# EAGLE design atmega328_dip_board (EAGLE 9.6.2)
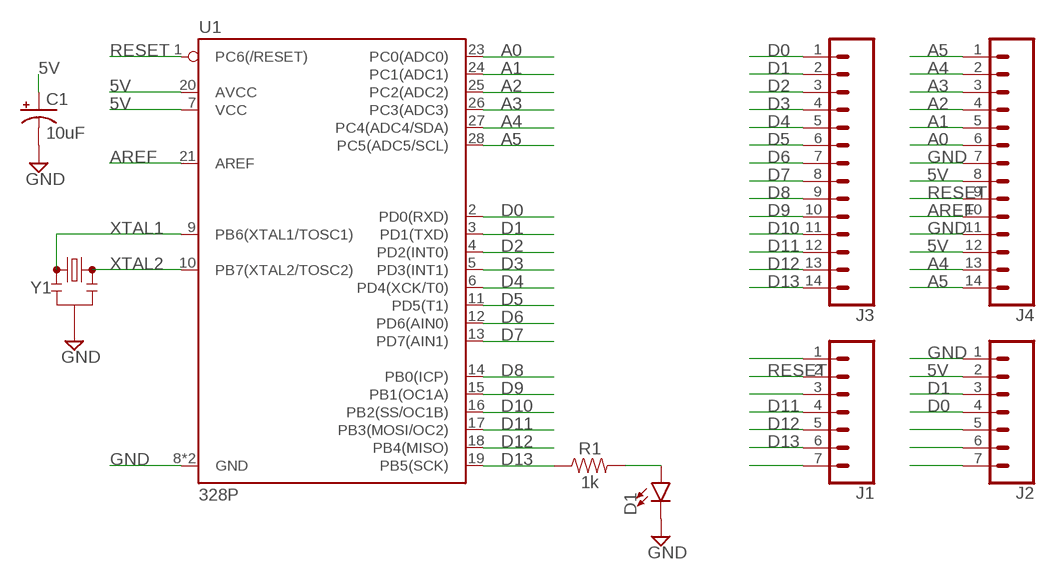
[diagram p0: schematic, sheet 1]

## Parts
C1  10uF  10UF-POLAR-RADIAL-2.5MM-25V-20%  [CPOL-RADIAL-2.5MM-5MM]
D1  LED5MM  [LED_5MM]
J1  CONN_07NO_SILK  [1X07_NO_SILK]
J2  CONN_07NO_SILK  [1X07_NO_SILK]
J3  CONN_14NO_SILK  [1X14_NO_SILK]
J4  CONN_14NO_SILK  [1X14_NO_SILK]
R1  1k  1KOHM-HORIZ-1/4W-5%  [AXIAL-0.3]
U1  328P  ATMEGA328P_PDIP  [DIP28]
Y1  RESONATORPTH-7.6X3.8  [RESONATOR-PTH-7.6X3.8]

## Nets
5V: C1.1(+) J2.2 J4.8 J4.12 U1.7(VCC) U1.20(AVCC)
A0: J4.6 U1.23(PC0(ADC0))
A1: J4.5 U1.24(PC1(ADC1))
A2: J4.4 U1.25(PC2(ADC2))
A3: J4.3 U1.26(PC3(ADC3))
A4: J4.2 J4.13 U1.27(PC4(ADC4/SDA))
A5: J4.1 J4.14 U1.28(PC5(ADC5/SCL))
AREF: J4.10 U1.21(AREF)
D0: J2.4 J3.1 U1.2(PD0(RXD))
D1: J2.3 J3.2 U1.3(PD1(TXD))
D2: J3.3 U1.4(PD2(INT0))
D3: J3.4 U1.5(PD3(INT1))
D4: J3.5 U1.6(PD4(XCK/T0))
D5: J3.6 U1.11(PD5(T1))
D6: J3.7 U1.12(PD6(AIN0))
D7: J3.8 U1.13(PD7(AIN1))
D8: J3.9 U1.14(PB0(ICP))
D9: J3.10 U1.15(PB1(OC1A))
D10: J3.11 U1.16(PB2(SS/OC1B))
D11: J1.4 J3.12 U1.17(PB3(MOSI/OC2))
D12: J1.5 J3.13 U1.18(PB4(MISO))
D13: J1.6 J3.14 R1.P$1 U1.19(PB5(SCK))
GND: C1.2(-) D1.K(C) J2.1 J4.7 J4.11 U1.8(GND) U1.22(GND) Y1.2
N$1: J1.1
N$2: D1.A R1.P$2
N$3: J1.3
N$5: J2.5
N$6: J2.6
N$7: J2.7
N$10: J1.7
RESET: J1.2 J4.9 U1.1(PC6(/RESET))
XTAL1: U1.9(PB6(XTAL1/TOSC1)) Y1.1
XTAL2: U1.10(PB7(XTAL2/TOSC2)) Y1.3

## Library data of the parts
C1 = SparkFun-Capacitors:10UF-POLAR: 10.0µF polarized capacitors A capacitor is a passive two-terminal electrical component used to store electrical energy temporarily in an electric field.; PROD_ID: CAP-08440
D1 = SparkFun-LED:LED: LED (Generic) Standard schematic elements and footprints for 5mm, 3mm, 1206, and 0603 sized LEDs. Generic LEDs with no color specified.
J1 J2 = SparkFun-Connectors:CONN_07: Multi connection point. Often used as Generic Header-pin footprint for 0.1 inch spaced/style header connections On any of the 0.1 inch spaced packages, you can populate with these: Break Away Headers - Straight <https://www.sparkfun.com/products/116> (PRT-00116) Break Away Male Headers - Right Angle <https://www.sparkfun.com/products/553> (PRT-00553) Female Headers <https://www.sparkfun.com/products/115> (PRT-00115) Break Away Headers - Machine Pin <https://www.sparkfun.com/products/117> (PRT-00117) Break Away Female Headers - Swiss Machine Pin <https://www.sparkfun.com/products/743> (PRT-00743) For SCREWTERMINALS and SPRING TERMINALS visit here: Screw Terimnals on SparkFun.com <https://www.sparkfun.com/search/results?term=Screw+Terminals> (5mm/3.5mm/2.54mm spacing) This device is also useful as a general connection point to wire up your design to another part of your project. Our various solder wires solder well into these plated through hole pads. Hook-Up Wire - Assortment (Stranded, 22 AWG) <https://www.sparkfun.com/products/11375> (PRT-11375) Hook-Up Wire - Assortment (Solid Core, 22 AWG) <https://www.sparkfun.com/products/11367> (PRT-11367) View the entire wire category on our website here <https://www.sparkfun.com/categories/141> Special notes: Molex polarized connector foot print use with SKU : PRT-08231 with associated crimp pins and housings. 1MM SMD Version SKU: PRT-10208 NOTES ON THE VARIANTS LOCK and LOCK_LONGPADS... This footprint was designed to help hold the alignment of a through-hole component (i.e. 6-pin header) while soldering it into place. You may notice that each hole has been shifted either up or down by 0.005 of an inch from it's more standard position (which is a perfectly straight line). This slight alteration caused the pins (the squares in the middle) to touch the edges of the holes. Because they are alternating, it causes a "brace" to hold the component in place. 0.005 has proven to be the perfect amount of "off-center" position when using our standard breakaway headers. Although looks a little odd when you look at the bare footprint, once you have a header in there, the alteration is very hard to notice. Also,if you push a header all the way into place, it is covered up entirely on the bottom side.
J3 J4 = SparkFun-Connectors:CONN_14: Multi connection point. Often used as Generic Header-pin footprint for 0.1 inch spaced/style header connections On any of the 0.1 inch spaced packages, you can populate with these: Break Away Headers - Straight <https://www.sparkfun.com/products/116> (PRT-00116) Break Away Male Headers - Right Angle <https://www.sparkfun.com/products/553> (PRT-00553) Female Headers <https://www.sparkfun.com/products/115> (PRT-00115) Break Away Headers - Machine Pin <https://www.sparkfun.com/products/117> (PRT-00117) Break Away Female Headers - Swiss Machine Pin <https://www.sparkfun.com/products/743> (PRT-00743) For SCREWTERMINALS and SPRING TERMINALS visit here: Screw Terimnals on SparkFun.com <https://www.sparkfun.com/search/results?term=Screw+Terminals> (5mm/3.5mm/2.54mm spacing) This device is also useful as a general connection point to wire up your design to another part of your project. Our various solder wires solder well into these plated through hole pads. Hook-Up Wire - Assortment (Stranded, 22 AWG) <https://www.sparkfun.com/products/11375> (PRT-11375) Hook-Up Wire - Assortment (Solid Core, 22 AWG) <https://www.sparkfun.com/products/11367> (PRT-11367) View the entire wire category on our website here <https://www.sparkfun.com/categories/141> Special notes: Molex polarized connector foot print use with SKU : PRT-08231 with associated crimp pins and housings. 1MM SMD Version SKU: PRT-10208 NOTES ON THE VARIANTS LOCK and LOCK_LONGPADS... This footprint was designed to help hold the alignment of a through-hole component (i.e. 6-pin header) while soldering it into place. You may notice that each hole has been shifted either up or down by 0.005 of an inch from it's more standard position (which is a perfectly straight line). This slight alteration caused the pins (the squares in the middle) to touch the edges of the holes. Because they are alternating, it causes a "brace" to hold the component in place. 0.005 has proven to be the perfect amount of "off-center" position when using our standard breakaway headers. Although looks a little odd when you look at the bare footprint, once you have a header in there, the alteration is very hard to notice. Also,if you push a header all the way into place, it is covered up entirely on the bottom side.
R1 = SparkFun-Resistors:1KOHM: 1kΩ resistor A resistor is a passive two-terminal electrical component that implements electrical resistance as a circuit element. Resistors act to reduce current flow, and, at the same time, act to lower voltage levels within circuits. - Wikipedia; PROD_ID: RES-08380
U1 = SparkFun-IC-Microcontroller:ATMEGA328P_PDIP: Atmel 328P Through hole ATMEGA328P uC used in the Arduino 32kb flash, 1k EEPROM, 2k SRAM Datasheet <http://www.sparkfun.com/datasheets/Components/SMD/ATMega328.pdf> SparkFun Products Storefront component: AVR 28 Pin 20MHz 32K 6A/D - ATMega328P <https://www.sparkfun.com/products/9061> (COM-09061) SparkFun Simon Says - Through-Hole Soldering Kit <https://www.sparkfun.com/products/10547> (KIT-10547) SparkFun Learn to Solder - Simon Says <https://www.sparkfun.com/products/13708> (KIT-13708) SparkFun BigTime Watch Kit <https://www.sparkfun.com/products/11734> (KIT-11734) SparkFun ClockIt <https://www.sparkfun.com/products/10930> (KIT-10930) SparkFun Serial Enabled LCD Kit <https://www.sparkfun.com/products/10097> (LCD-10097) SparkFun Simon Tilts - Through Hole Soldering Kit <https://www.sparkfun.com/products/12634> (KIT-12634) SparkFun Frequency Counter Kit <https://www.sparkfun.com/products/10140> (KIT-10140) FabFM Radio Kit <https://www.sparkfun.com/products/11043> (KIT-11043) SparkFun Binary Blaster Kit <https://www.sparkfun.com/products/12037> (KIT-12037) SparkFun Metro-Gnome <https://www.sparkfun.com/products/9236> (KIT-09236) ATmega328 with Arduino Optiboot (Uno) <https://www.sparkfun.com/products/10524> (DEV-10524); PROD_ID: IC-09136
Y1 = SparkFun-Clocks:RESONATOR: Resonators (Generic) Ceramic resonators are clock-generating components, often used to control timing in microcontrollers. They usually have 3 pins: two pins for oscillation, and one pin for ground. Compared to crystals, resonators have worse tolerance, but are usually much cheaper. Plus, they have built-in load capacitors! These devices are used on boards like the Arduino Pro 8MHz <https://www.sparkfun.com/products/11114> and Arduino Pro 16MHz <https://www.sparkfun.com/products/11113>.

## Board
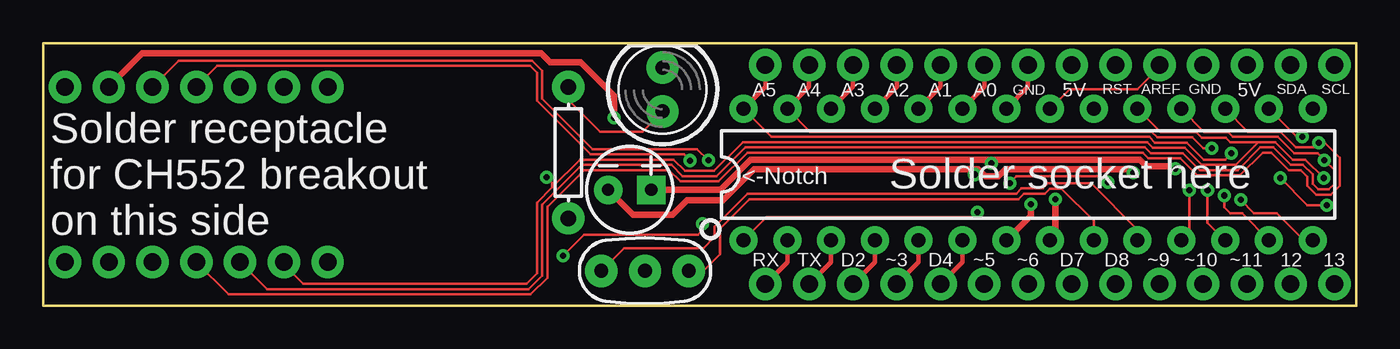
[diagram p1: board, top side]
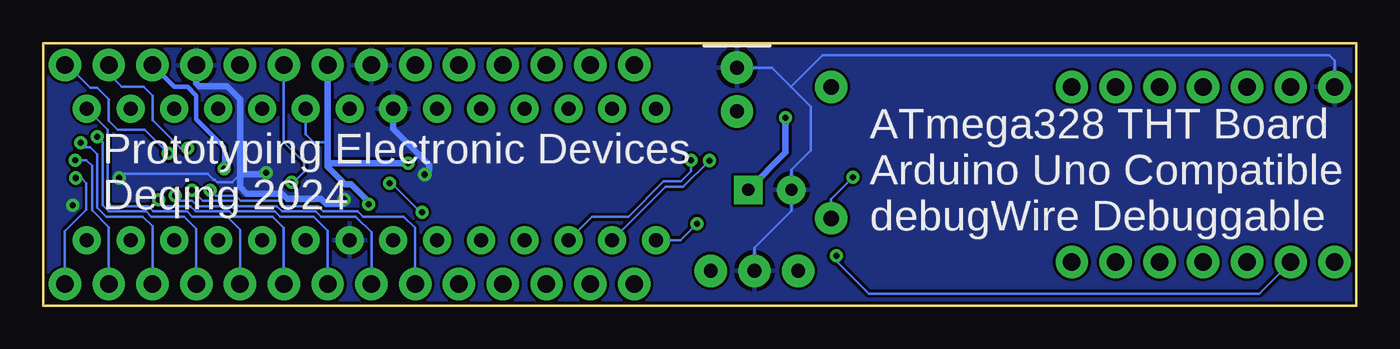
[diagram p2: board, bottom side, seen from below]

Size 76.2 x 15.24 mm. Coordinates in mm from the lower left corner, seen from the top.
Outline: 0,0 76.2,0 76.2,15.24 0,15.24 0,0
Copper layers (1*16): Top 0.035mm / dielectric 1.5mm / Bottom 0.035mm
Design rules "default *": minimum track width 6mil, minimum drill 0.35mm, track to track 6mil, track to pad 6mil, pad to pad 6mil, via to via 6mil, smd to smd 6mil, copper to edge 6mil, drill to drill 6mil, minimum pad ring 10mil, minimum via ring 8mil, stop-mask expansion 4mil, vias tented up to drill 15mil, thermal gap 10mil

### Footprints (pad centres in the part's own frame; a part is rotated, then mirrored left to right if it is on the bottom)
CPOL-RADIAL-2.5MM-5MM = drill 0.7 pad 1.651 square: 1 1.25,0 | drill 0.7 pad 1.651: 2 -1.25,0
LED_5MM = drill 0.813 pad 1.88: A -1.27,0; K 1.27,0
1X07_NO_SILK = drill 1.016 pad 1.88: 1 0,0; 2 2.54,0; 3 5.08,0; 4 7.62,0; 5 10.16,0; 6 12.7,0; 7 15.24,0
1X14_NO_SILK = drill 1.016 pad 1.88: 1 0,0; 2 2.54,0; 3 5.08,0; 4 7.62,0; 5 10.16,0; 6 12.7,0; 7 15.24,0; 8 17.78,0; 9 20.32,0; 10 22.86,0; 11 25.4,0; 12 27.94,0; 13 30.48,0; 14 33.02,0
AXIAL-0.3 = drill 0.9 pad 1.88: P$1 -3.81,0; P$2 3.81,0
DIP28 = drill 0.813 pad 1.626: 1 -16.51,-3.81; 2 -13.97,-3.81; 3 -11.43,-3.81; 4 -8.89,-3.81; 5 -6.35,-3.81; 6 -3.81,-3.81; 7 -1.27,-3.81; 8 1.27,-3.81; 9 3.81,-3.81; 10 6.35,-3.81; 11 8.89,-3.81; 12 11.43,-3.81; 13 13.97,-3.81; 14 16.51,-3.81; 15 16.51,3.81; 16 13.97,3.81; 17 11.43,3.81; 18 8.89,3.81; 19 6.35,3.81; 20 3.81,3.81; 21 1.27,3.81; 22 -1.27,3.81; 23 -3.81,3.81; 24 -6.35,3.81; 25 -8.89,3.81; 26 -11.43,3.81; 27 -13.97,3.81; 28 -16.51,3.81
RESONATOR-PTH-7.6X3.8 = drill 0.8 pad 1.88: 1 -2.54,0; 2 0,0; 3 2.54,0

### Placement (x,y rotation side)
C1  34.04,6.73 0 top
D1  35.94,12.55 90 top
J1  1.27,2.54 0 top
J2  1.27,12.7 0 top
J3  41.91,1.27 0 top
J4  41.91,13.97 0 top
R1  30.48,8.89 90 top
U1  57.15,7.62 0 top
Y1  34.92,2.03 180 top

### Tracks (layer width: path | path; a pad name or v marks a point on that pad's centre or on a via)
5V  (via drill 0.35)
  Top 0.381: v57.3,5.89 57.3,5.23 U1.7 | v65.68,7.95 65.53,8.11 64,8.11 63.63,8.47 54.91,8.47 | 54.91,8.47 54.91,8.38 v55.02,8.28 | J2.2 5.75,14.64 28.89,14.64 29.41,14.12 31.19,14.12 33.12,12.19 v33.12,10.92 | C1.1 39.3,6.73 41.04,8.47 54.91,8.47
  Bottom 0.152: 59.69,9.55 59.74,9.5 60.5,9.5 60.96,9.96 U1.20
  Bottom 0.254: J4.12 68.58,12.7 67.82,12.7 67.31,12.19 67.31,10.82 65.68,9.2 v65.68,7.95
  Bottom 0.381: J4.8 59.69,9.55 59.69,8.28 | 59.69,8.28 59.69,8.08 58.67,7.06 58.32,7.06 57.3,6.04 v57.3,5.89 | v55.02,8.28 59.69,8.28 | v33.12,10.92 33.12,8.89 C1.1
A0
  Top 0.254: J4.6 54.61,12.7 U1.23
A1
  Top 0.254: J4.5 52.07,12.7 U1.24
A2
  Top 0.254: J4.4 49.53,12.7 U1.25
A3
  Top 0.254: J4.3 46.99,12.7 U1.26
A4  (via drill 0.35)
  Top 0.152: v67.82,9.14 67.31,9.14 66.67,9.78 64.64,9.78 64.31,10.11 44.5,10.11 U1.27
  Top 0.254: J4.2 44.45,12.7 U1.27
  Bottom 0.152: J4.13 72.39,13.46 71.63,12.7 70.36,12.7 69.85,12.19 69.85,10.77 68.22,9.14 v67.82,9.14
A5  (via drill 0.35)
  Top 0.152: U1.28 42.27,9.8 64.19,9.8 64.52,9.47 66.37,9.47 67.36,8.48 68.58,8.48 v68.94,8.84
  Top 0.254: U1.28 41.91,12.7 J4.1
  Bottom 0.152: J4.14 74.78,13.97 73.46,12.65 73.05,12.65 72.39,11.99 72.39,10.74 71.86,10.21 70.31,10.21 v68.94,8.84
AREF
  Top 0.152: U1.21 59.56,12.57 63.5,12.57 64.77,13.84 J4.10
D0  (via drill 0.35)
  Top 0.152: J2.4 10.11,13.92 28.25,13.92 28.65,13.51 28.65,11.89 31.75,8.79 37.18,8.79 v37.54,8.43
  Top 0.254: U1.2 43.18,2.54 J3.1
  Bottom 0.152: U1.2 40.08,6.91 39.06,6.91 v37.54,8.43
D1  (via drill 0.35)
  Top 0.152: J2.3 7.87,14.22 28.37,14.22 28.96,13.64 28.96,12.01 31.88,9.09 37.95,9.09 v38.61,8.43
  Top 0.254: U1.3 45.72,2.54 J3.2
  Bottom 0.152: U1.3 44.35,5.18 42.24,5.18 40.21,7.21 39.19,7.21 38.61,7.8 v38.61,8.43
D2
  Top 0.254: U1.4 48.26,2.54 J3.3
D3
  Top 0.254: U1.5 50.8,2.54 J3.4
D4
  Top 0.254: U1.6 53.34,2.54 J3.5
D5  (via drill 0.35)
  Top 0.152: U1.11 66.5,4.27 v66.5,6.71
  Bottom 0.152: v66.5,6.71 66.19,6.4 65.03,6.4 64.72,6.1 62.51,6.1 62.21,5.79 60.25,5.79 59.95,5.49 57.94,5.49 57.63,5.18 55.27,5.18 54.61,4.52 J3.6
D6  (via drill 0.35)
  Top 0.152: U1.12 67.56,4.83 v67.56,6.71
  Bottom 0.152: J3.7 57.15,4.27 58.06,5.18 60.07,5.18 60.38,5.49 62.33,5.49 62.64,5.79 64.85,5.79 65.15,6.1 66.95,6.1 v67.56,6.71
D7  (via drill 0.35)
  Top 0.152: U1.13 69.57,5.36 68.89,5.36 68.53,5.71 v68.53,6.4
  Bottom 0.152: J3.8 59.69,4.37 60.5,5.18 62.46,5.18 62.76,5.49 64.97,5.49 65.28,5.79 67.23,5.79 67.54,6.1 68.22,6.1 v68.53,6.4
D8  (via drill 0.35)
  Top 0.152: v69.49,6.15 70.26,5.38 71.58,5.38 73.15,3.81 U1.14
  Bottom 0.152: J3.9 62.23,4.52 62.89,5.18 65.1,5.18 65.41,5.49 67.36,5.49 67.67,5.79 69.14,5.79 v69.49,6.15
D9
  Bottom 0.152: J3.10 64.77,4.42 65.53,5.18 67.54,5.18 67.84,5.49 69.8,5.49 70.1,5.79 72.24,5.79 72.44,6 72.44,10.21 U1.15
D10  (via drill 0.35)
  Top 0.152: v73.05,9.8 72.75,9.8 U1.16
  Bottom 0.152: J3.11 67.31,4.47 68.02,5.18 69.92,5.18 70.23,5.49 72.39,5.49 72.75,5.84 72.75,9.5 v73.05,9.8
D11  (via drill 0.35)
  Top 0.152: U1.17 69.9,10.11 71.78,10.11 72.69,9.2 73.76,9.2 v74.02,9.45 74.37,9.45 75.23,8.59 75.23,6.97 74.72,6.45 73.87,6.45 73.36,6.97 73.36,7.49 72.97,7.87 72.27,7.87 71.25,8.89 70.76,8.89 69.44,7.57 66.98,7.57 65.99,8.56 64.14,8.56 63.81,8.89 40.87,8.89 39.19,7.21 36.98,7.21 36.32,7.87 31.39,7.87 29.26,5.74 29.26,1.63 28.3,0.66 10.77,0.66 J1.4
  Bottom 0.152: v74.02,9.45 73.76,9.2 73.46,9.2 73.05,8.79 73.05,5.69 72.54,5.18 70.41,5.18 69.85,4.62 J3.12
D12  (via drill 0.35)
  Top 0.152: U1.18 67.39,10.08 68.76,10.08 69.04,9.8 71.63,9.8 72.59,8.84 73.97,8.84 v74.35,8.46 74.93,7.87 74.93,7.09 74.6,6.76 73.99,6.76 73.66,7.09 73.66,7.62 73.1,8.18 72.39,8.18 71.38,9.2 70.64,9.2 69.32,7.87 67.11,7.87 66.12,8.87 64.26,8.87 63.93,9.2 40.74,9.2 39.06,7.52 37.11,7.52 36.45,8.18 31.27,8.18 28.96,5.87 28.96,1.75 28.17,0.96 13.01,0.96 J1.5
  Bottom 0.152: J3.13 72.39,4.57 73.36,5.54 73.36,8.13 73.69,8.46 v74.35,8.46
D13  (via drill 0.35)
  Top 0.152: v74.3,7.42 73.23,8.48 72.52,8.48 71.5,9.5 70.51,9.5 | U1.19 64.85,10.08 66.9,10.08 67.23,9.75 68.63,9.75 68.89,9.5 70.51,9.5 | 70.51,9.5 69.19,8.18 67.23,8.18 66.24,9.17 64.39,9.17 64.06,9.5 40.62,9.5 38.94,7.82 37.23,7.82 36.58,8.48 31.14,8.48 29.54,6.88 | J1.6 13.97,2.39 15.09,1.27 28.04,1.27 28.65,1.88 28.65,5.99 29.54,6.88 | 29.54,6.88 29.54,7.14 v29.21,7.47
  Bottom 0.152: J3.14 74.93,4.32 73.69,5.56 73.69,7.11 73.99,7.42 v74.3,7.42 | v29.21,7.47 30.48,6.2 R1.P$1
GND  (via drill 0.35)
  Top 0.152: v71.78,7.42 73.36,5.84 v74.47,5.84
  Top 0.254: J4.7 57.15,12.7 U1.22
  Top 0.381: v58.73,6.2 58.73,4.12 U1.8 | v63.25,7.72 63.04,7.92 55.83,7.92 55.42,7.52 54.66,7.52 54.25,7.92 | v54.05,7.62 54.25,7.82 54.25,7.92 | C1.2 34.23,5.28 36.52,5.28 37.36,6.12 39.45,6.12 41.25,7.92 54.25,7.92
  Bottom 0.152: Y1.2 34.92,3.38 32.79,5.52 C1.2 32.79,7.9 31.65,9.04 31.65,11.56 32.8,12.71 | D1.K 33.91,13.82 32.8,12.71 | J2.1 1.27,14.22 1.57,14.53 30.99,14.53 32.8,12.71 | 64.77,7.62 65.23,7.16 66.1,7.16 66.25,7.31 66.29,7.31 66.65,7.67 71.58,7.67 71.78,7.47 v71.78,7.42
  Bottom 0.381: J4.11 67.31,12.9 67.16,12.75 65.53,12.75 64.77,11.99 64.77,7.62 | 64.77,7.62 64.77,6.91 64.38,6.51 62.34,6.51 62.03,6.21 60.08,6.21 59.77,5.91 58.73,5.91 v58.73,6.2 | 64.77,7.62 63.6,7.62 63.45,7.77 63.3,7.77 v63.25,7.72 | U1.22 55.88,10.26 53.8,8.18 53.8,7.87 v54.05,7.62
  pour Bottom: 0.13,0.13 76.07,0.13 76.07,15.11 0.13,15.11
N$2
  Top 0.152: D1.A 34.77,10.11 32.31,10.11 30.48,11.94 R1.P$2
RESET  (via drill 0.35)
  Top 0.152: v61.77,7.16 61.52,7.16 61.18,7.51 56.48,7.51 v56.08,7.11 | v54.2,5.44 53.9,5.13 41.96,5.13 U1.1 | v30.18,2.9 31.39,4.12 38,4.12 38.26,4.37 v38.26,4.78
  Bottom 0.152: J4.9 62.23,9.5 61.06,8.33 61.06,7.77 61.67,7.16 v61.77,7.16 | v56.08,7.11 55.98,7.11 54.3,5.44 v54.2,5.44 | J1.2 5.64,0.71 28.3,0.71 30.18,2.59 v30.18,2.9 | v38.26,4.78 39.22,3.81 U1.1
XTAL1
  Top 0.152: U1.9 60.96,4.93 59.09,6.8 58.42,6.8 58.12,6.5 56.9,6.5 56.59,6.2 41,6.2 39.27,4.47 39.27,3 38.3,2.03 Y1.1
XTAL2
  Top 0.152: U1.10 63.5,4.42 60.81,7.11 58.3,7.11 58,6.81 56.77,6.81 56.47,6.5 40.87,6.5 38.96,4.6 38.96,4.01 38.3,3.35 33.71,3.35 Y1.3

### Text on the board
tNames: A5 | A4 | A3 | A2 | A1 | A0 | GND | 5V | RST | AREF | GND | 5V | SDA | SCL | <-Notch | Solder socket here | Solder receptacle / for CH552 breakout / on this side | RX | TX | D2 | ~3 | D4 | ~5 | ~6 | D7 | D8 | ~9 | ~10 | ~11 | 12 | 13
bNames: Prototyping Electronic Devices / Deqing 2024 | ATmega328 THT Board / Arduino Uno Compatible / debugWire Debuggable